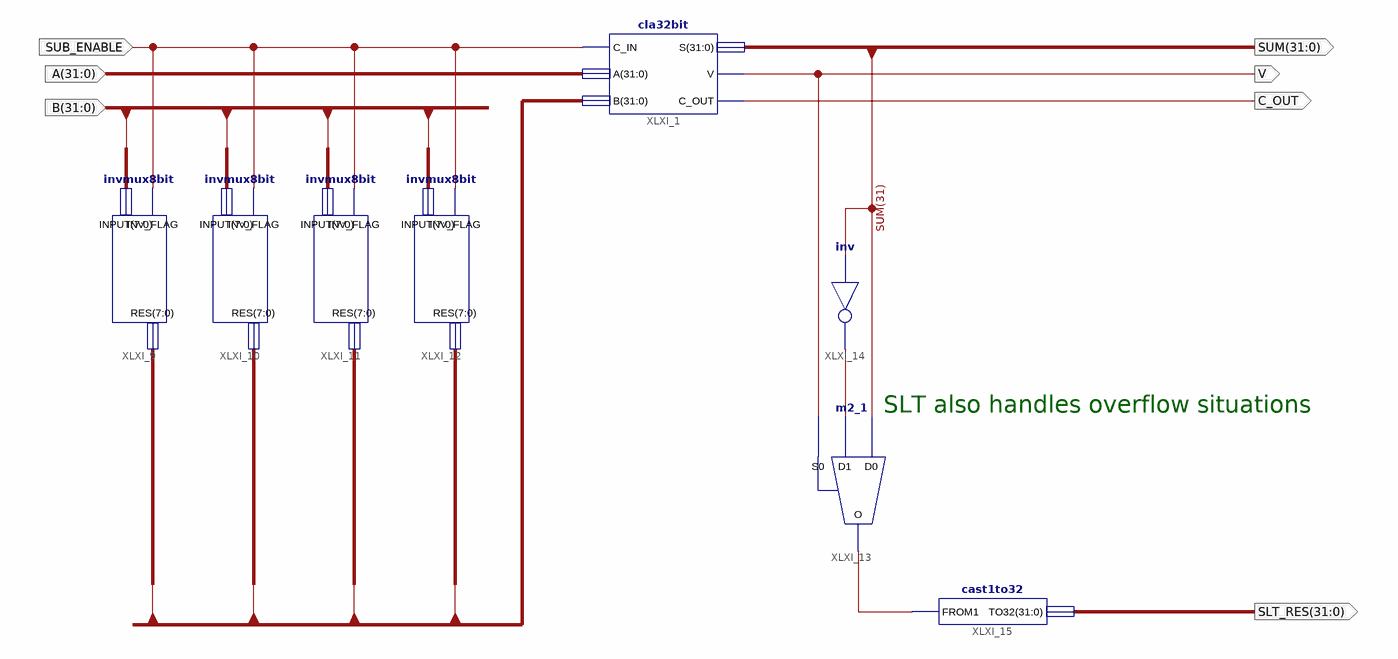
[diagram p0: schematic sheet 1]
// Xilinx ISE schematic addsubslt32bit.sch (spartan3e) as structural Verilog: 8 symbols, 7 ports
module addsubslt32bit (
  input  SUB_ENABLE,
  input  [31:0] A,
  input  [31:0] B,
  output [31:0] SUM,
  output V,
  output C_OUT,
  output [31:0] SLT_RES
);

  wire XLXN_17, XLXN_26;
  wire [31:0] B2;

  invmux8bit XLXI_9 (.INV_FLAG(SUB_ENABLE), .INPUT(B[31:24]), .RES(B2[31:24]));
  invmux8bit XLXI_10 (.INV_FLAG(SUB_ENABLE), .INPUT(B[23:16]), .RES(B2[23:16]));
  invmux8bit XLXI_11 (.INV_FLAG(SUB_ENABLE), .INPUT(B[15:8]), .RES(B2[15:8]));
  invmux8bit XLXI_12 (.INV_FLAG(SUB_ENABLE), .INPUT(B[7:0]), .RES(B2[7:0]));
  cla32bit XLXI_1 (.C_IN(SUB_ENABLE), .B(B2), .A(A), .S(SUM), .V(V), .C_OUT(C_OUT));
  m2_1 XLXI_13 (.D0(SUM[31]), .D1(XLXN_17), .S0(V), .O(XLXN_26));
  not XLXI_14 (XLXN_17, SUM[31]);
  cast1to32 XLXI_15 (.FROM1(XLXN_26), .TO32(SLT_RES));

  // Notes on the sheet:
  //   SLT also handles overflow situations
endmodule
